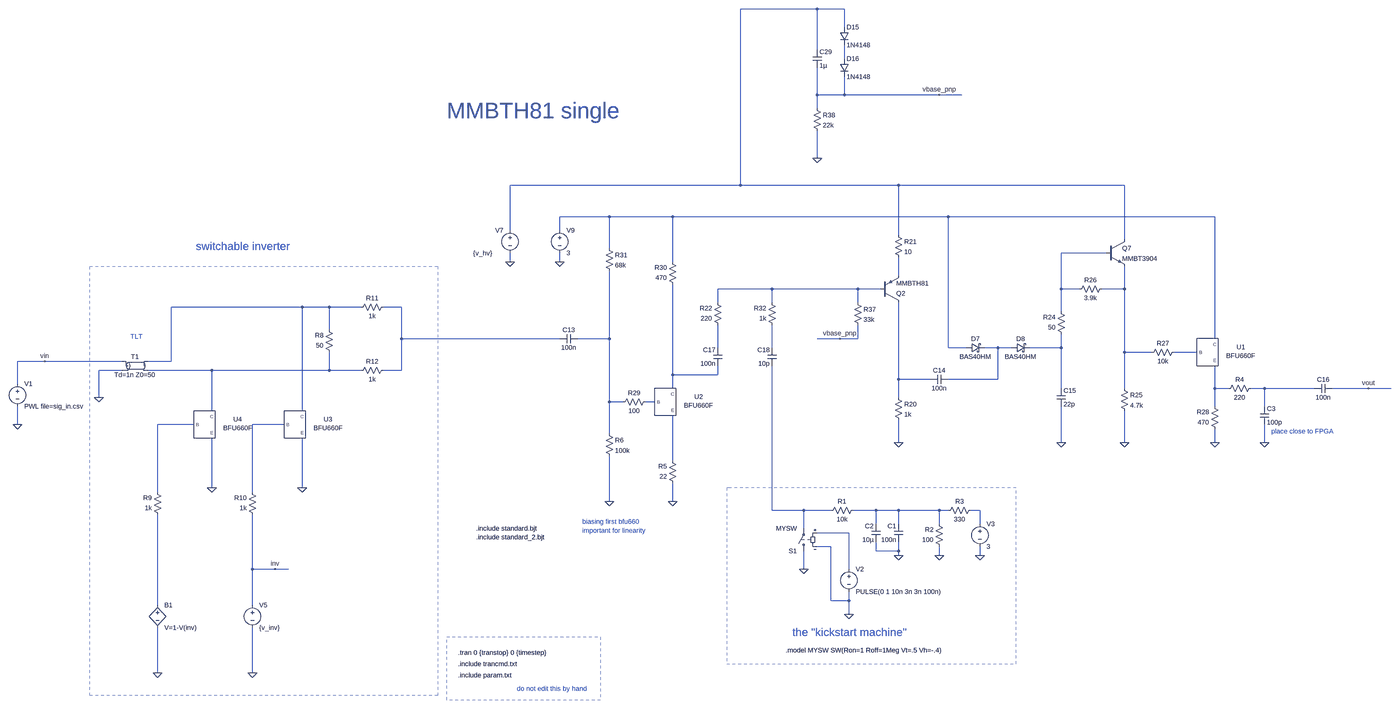
[diagram p0: schematic h81_kickstart_swinv.asc, whole sheet]
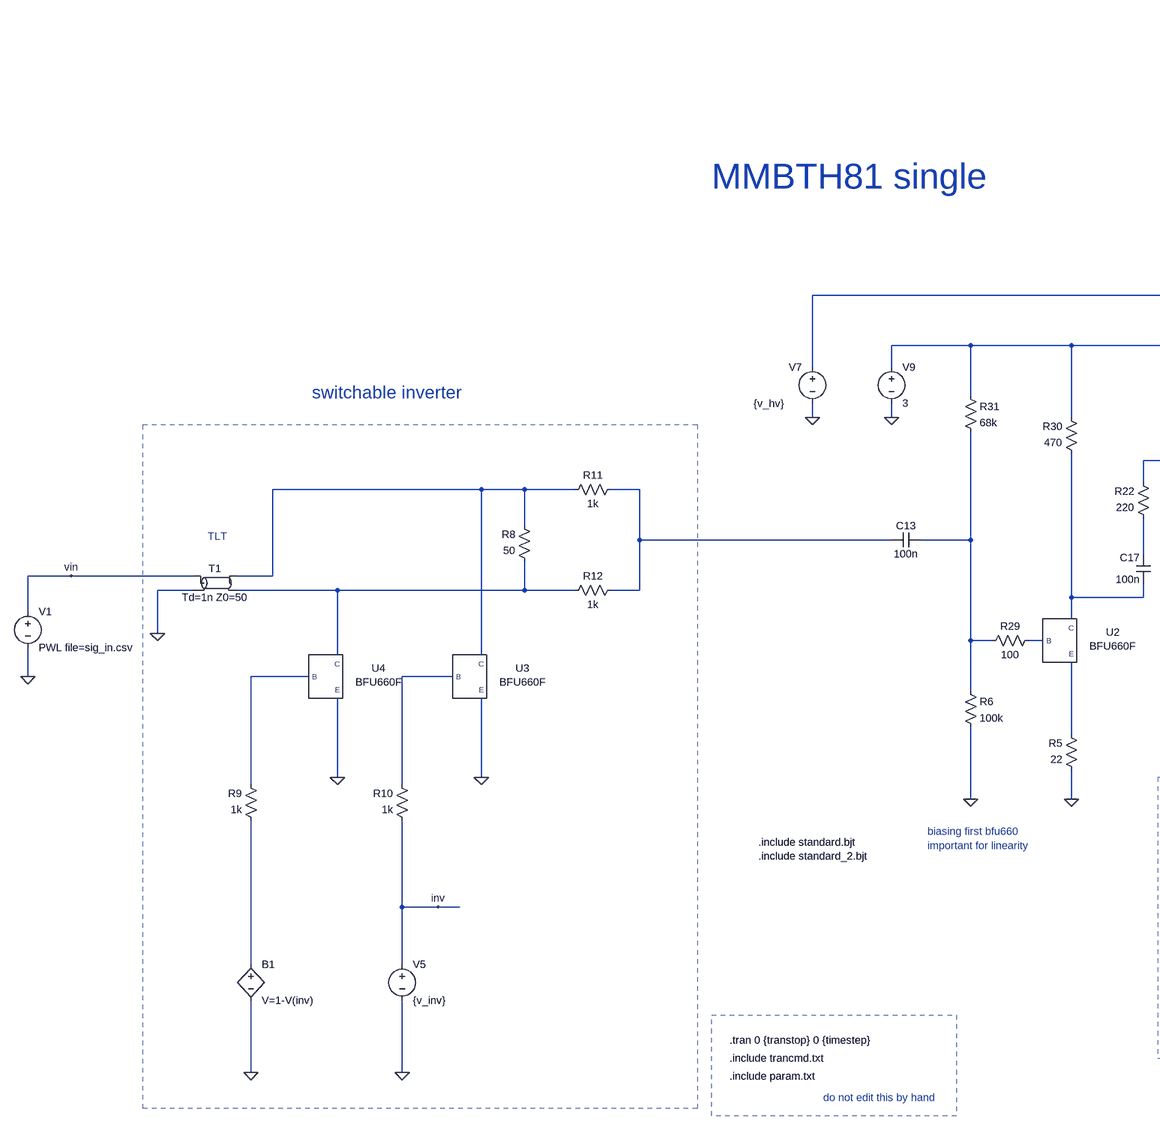
[diagram p1: schematic h81_kickstart_swinv.asc, part, row 1 of 1, column 1 of 2]
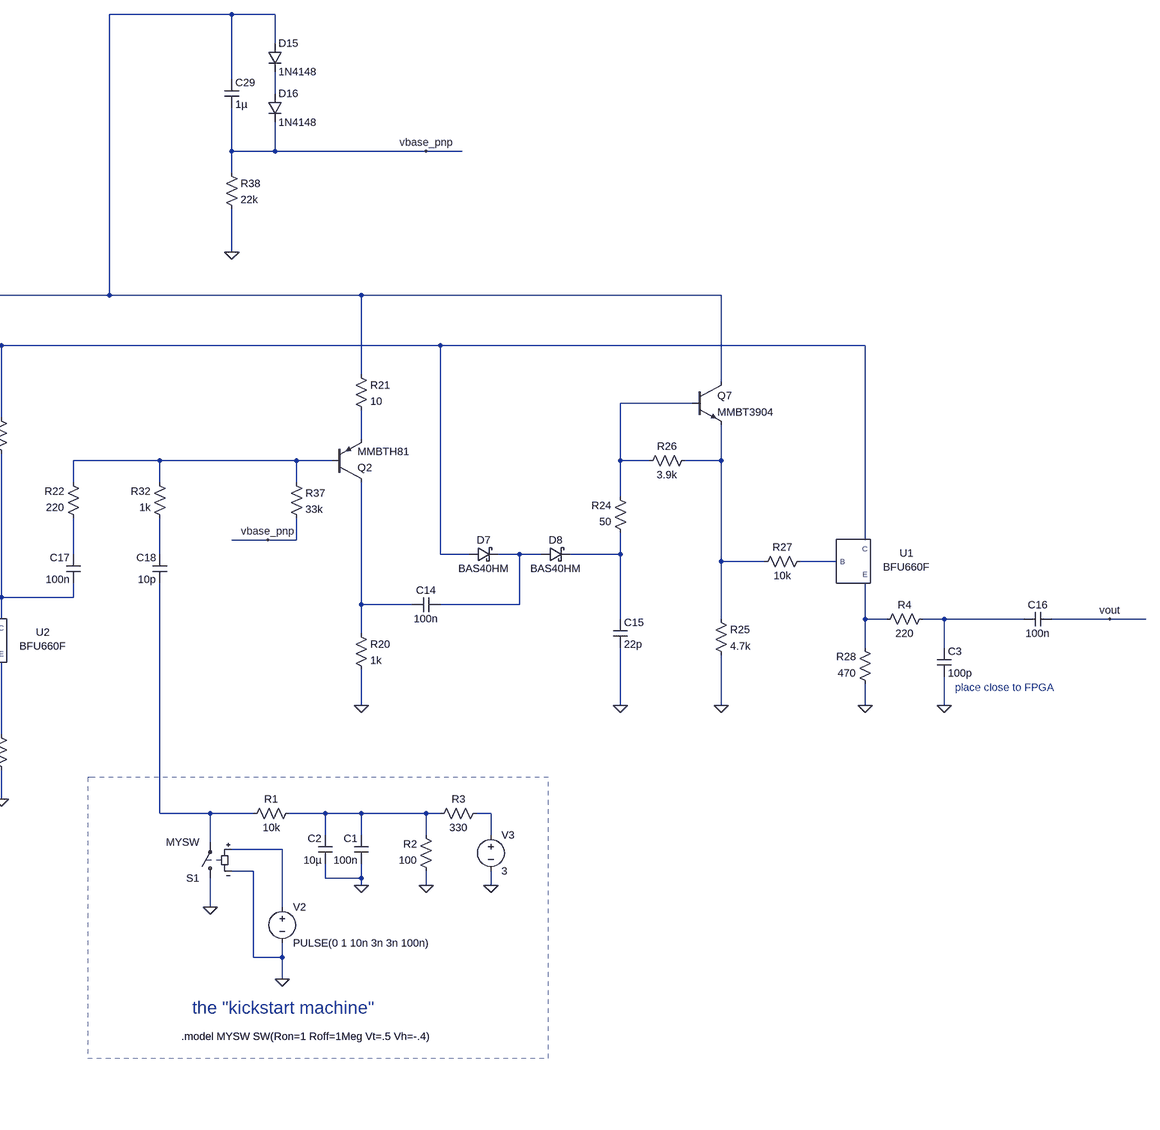
[diagram p2: schematic h81_kickstart_swinv.asc, part, row 1 of 1, column 2 of 2]
h81_kickstart_swinv.asc, the LTspice schematic file:
Version 4
SHEET 1 25452 10420
WIRE 19504 5040 19232 5040
WIRE 19600 5040 19504 5040
WIRE 19600 5104 19600 5040
WIRE 19504 5184 19504 5040
WIRE 19600 5216 19600 5168
WIRE 19504 5344 19504 5248
WIRE 19600 5344 19600 5280
WIRE 19600 5344 19504 5344
WIRE 19936 5344 19600 5344
WIRE 20016 5344 19936 5344
WIRE 19504 5392 19504 5344
WIRE 19504 5568 19504 5472
WIRE 19232 5664 19232 5040
WIRE 19232 5664 18416 5664
WIRE 19792 5664 19232 5664
WIRE 20592 5664 19792 5664
WIRE 18768 5776 18592 5776
WIRE 18992 5776 18768 5776
WIRE 19968 5776 18992 5776
WIRE 20912 5776 19968 5776
WIRE 18416 5824 18416 5664
WIRE 18592 5824 18592 5776
WIRE 19792 5840 19792 5664
WIRE 20592 5856 20592 5664
WIRE 18768 5888 18768 5776
WIRE 20528 5904 20368 5904
WIRE 18416 5936 18416 5904
WIRE 18592 5936 18592 5904
WIRE 18992 5936 18992 5776
WIRE 19792 5984 19792 5920
WIRE 19344 6032 19152 6032
WIRE 19648 6032 19344 6032
WIRE 19728 6032 19648 6032
WIRE 20368 6032 20368 5904
WIRE 20432 6032 20368 6032
WIRE 20592 6032 20592 5952
WIRE 20592 6032 20512 6032
WIRE 19152 6080 19152 6032
WIRE 19344 6080 19344 6032
WIRE 19648 6080 19648 6032
WIRE 17680 6096 17216 6096
WIRE 17776 6096 17680 6096
WIRE 17888 6096 17776 6096
WIRE 18032 6096 17968 6096
WIRE 20368 6112 20368 6032
WIRE 17776 6176 17776 6096
WIRE 18032 6208 18032 6096
WIRE 18592 6208 18032 6208
WIRE 18768 6208 18768 5968
WIRE 18768 6208 18656 6208
WIRE 19584 6208 19504 6208
WIRE 19648 6208 19648 6160
WIRE 19648 6208 19584 6208
WIRE 20912 6208 20912 5776
WIRE 19152 6240 19152 6160
WIRE 19344 6240 19344 6160
WIRE 19968 6240 19968 5776
WIRE 20032 6240 19968 6240
WIRE 20144 6240 20096 6240
WIRE 20192 6240 20144 6240
WIRE 20368 6240 20368 6192
WIRE 20368 6240 20256 6240
WIRE 20592 6256 20592 6032
WIRE 20688 6256 20592 6256
WIRE 20848 6256 20768 6256
WIRE 16768 6288 16672 6288
WIRE 17040 6288 16768 6288
WIRE 17216 6288 17216 6096
WIRE 17216 6288 17136 6288
WIRE 17040 6320 16960 6320
WIRE 17360 6320 17136 6320
WIRE 17776 6320 17776 6256
WIRE 17776 6320 17360 6320
WIRE 17888 6320 17776 6320
WIRE 18032 6320 18032 6208
WIRE 18032 6320 17968 6320
WIRE 18992 6336 18992 6016
WIRE 19152 6336 19152 6304
WIRE 19152 6336 18992 6336
WIRE 19792 6352 19792 6080
WIRE 19904 6352 19792 6352
WIRE 20144 6352 20144 6240
WIRE 20144 6352 19968 6352
WIRE 16672 6368 16672 6288
WIRE 18992 6384 18992 6336
WIRE 20368 6384 20368 6240
WIRE 20592 6384 20592 6256
WIRE 20912 6384 20912 6304
WIRE 20960 6384 20912 6384
WIRE 21088 6384 21040 6384
WIRE 21264 6384 21088 6384
WIRE 21456 6384 21328 6384
WIRE 21536 6384 21456 6384
WIRE 16960 6416 16960 6320
WIRE 19792 6416 19792 6352
WIRE 18768 6432 18768 6208
WIRE 18816 6432 18768 6432
WIRE 18928 6432 18896 6432
WIRE 20912 6448 20912 6384
WIRE 21088 6448 21088 6384
WIRE 17360 6464 17360 6320
WIRE 17680 6464 17680 6096
WIRE 16672 6512 16672 6448
WIRE 17296 6512 17168 6512
WIRE 17616 6512 17504 6512
WIRE 18768 6544 18768 6432
WIRE 19792 6576 19792 6496
WIRE 20368 6576 20368 6448
WIRE 20592 6576 20592 6464
WIRE 20912 6576 20912 6528
WIRE 21088 6576 21088 6512
WIRE 18992 6640 18992 6480
WIRE 17360 6736 17360 6560
WIRE 17680 6736 17680 6560
WIRE 17168 6752 17168 6512
WIRE 17504 6752 17504 6512
WIRE 18768 6784 18768 6624
WIRE 18992 6784 18992 6720
WIRE 19344 6816 19344 6304
WIRE 19456 6816 19344 6816
WIRE 19552 6816 19456 6816
WIRE 19712 6816 19632 6816
WIRE 19792 6816 19712 6816
WIRE 19936 6816 19792 6816
WIRE 19968 6816 19936 6816
WIRE 20080 6816 20048 6816
WIRE 19712 6864 19712 6816
WIRE 19792 6864 19792 6816
WIRE 19936 6864 19936 6816
WIRE 20080 6864 20080 6816
WIRE 19456 6880 19456 6816
WIRE 19616 6896 19504 6896
WIRE 19552 6944 19504 6944
WIRE 19712 6960 19712 6928
WIRE 19792 6960 19792 6928
WIRE 19792 6960 19712 6960
WIRE 19792 6976 19792 6960
WIRE 19936 6976 19936 6944
WIRE 20080 6976 20080 6944
WIRE 17504 7024 17504 6832
WIRE 17584 7024 17504 7024
WIRE 17632 7024 17584 7024
WIRE 19456 7024 19456 6960
WIRE 19616 7024 19616 6896
WIRE 19552 7136 19552 6944
WIRE 19616 7136 19616 7104
WIRE 19616 7136 19552 7136
WIRE 17168 7152 17168 6832
WIRE 17504 7152 17504 7024
WIRE 19616 7184 19616 7136
WIRE 17168 7392 17168 7232
WIRE 17504 7392 17504 7232
FLAG 19792 6576 0
FLAG 20368 6576 0
FLAG 20592 6576 0
FLAG 20912 6576 0
FLAG 18592 5936 0
FLAG 18992 6784 0
FLAG 18416 5936 0
FLAG 19504 5568 0
FLAG 16768 6288 vin
FLAG 16672 6512 0
FLAG 21456 6384 vout
FLAG 19456 7024 0
FLAG 19616 7184 0
FLAG 20080 6976 0
FLAG 19936 6976 0
FLAG 19792 6976 0
FLAG 19584 6208 vbase_pnp
FLAG 19936 5344 vbase_pnp
FLAG 21088 6576 0
FLAG 18768 6784 0
FLAG 16960 6416 0
FLAG 17360 6736 0
FLAG 17680 6736 0
FLAG 17168 7392 0
FLAG 17504 7392 0
FLAG 17584 7024 inv
SYMBOL pnp 19728 6080 M180
SYMATTR InstName Q2
SYMATTR Value MMBTH81
SYMBOL res 19776 6400 R0
SYMATTR InstName R20
SYMATTR Value 1k
SYMBOL res 19776 5824 R0
SYMATTR InstName R21
SYMATTR Value 10
SYMBOL voltage 18416 5808 R0
WINDOW 123 0 0 Left 2
WINDOW 39 14 99 Left 2
WINDOW 0 -52 16 Left 2
WINDOW 3 -131 97 Left 2
SYMATTR InstName V7
SYMATTR Value {v_hv}
SYMBOL res 19168 6176 R180
WINDOW 0 36 76 Left 2
WINDOW 3 36 40 Left 2
SYMATTR InstName R22
SYMATTR Value 220
SYMBOL cap 18656 6192 R90
WINDOW 0 0 32 VBottom 2
WINDOW 3 32 32 VTop 2
SYMATTR InstName C13
SYMATTR Value 100n
SYMBOL cap 19968 6336 R90
WINDOW 0 0 32 VBottom 2
WINDOW 3 32 32 VTop 2
SYMATTR InstName C14
SYMATTR Value 100n
SYMBOL cap 20352 6384 R0
SYMATTR InstName C15
SYMATTR Value 22p
SYMBOL schottky 20032 6256 R270
WINDOW 3 0 32 VBottom 2
WINDOW 0 32 32 VTop 2
SYMATTR Value BAS40HM
SYMATTR InstName D7
SYMATTR Description Diode
SYMATTR Type diode
SYMBOL schottky 20192 6256 R270
WINDOW 3 0 32 VBottom 2
WINDOW 0 32 32 VTop 2
SYMATTR Value BAS40HM
SYMATTR InstName D8
SYMATTR Description Diode
SYMATTR Type diode
SYMBOL res 20384 6208 R180
WINDOW 0 36 76 Left 2
WINDOW 3 36 40 Left 2
SYMATTR InstName R24
SYMATTR Value 50
SYMBOL res 20576 6368 R0
SYMATTR InstName R25
SYMATTR Value 4.7k
SYMBOL npn 20528 5856 R0
SYMATTR InstName Q7
SYMATTR Value MMBT3904
SYMBOL res 20528 6016 R90
WINDOW 0 0 56 VBottom 2
WINDOW 3 32 56 VTop 2
SYMATTR InstName R26
SYMATTR Value 3.9k
SYMBOL res 20784 6240 R90
WINDOW 0 0 56 VBottom 2
WINDOW 3 32 56 VTop 2
SYMATTR InstName R27
SYMATTR Value 10k
SYMBOL res 20928 6544 R180
WINDOW 0 36 76 Left 2
WINDOW 3 36 40 Left 2
SYMATTR InstName R28
SYMATTR Value 470
SYMBOL cap 21328 6368 R90
WINDOW 0 0 32 VBottom 2
WINDOW 3 32 32 VTop 2
SYMATTR InstName C16
SYMATTR Value 100n
SYMBOL res 18912 6416 R90
WINDOW 0 0 56 VBottom 2
WINDOW 3 32 56 VTop 2
SYMATTR InstName R29
SYMATTR Value 100
SYMBOL res 19008 6032 R180
WINDOW 0 36 76 Left 2
WINDOW 3 36 40 Left 2
SYMATTR InstName R30
SYMATTR Value 470
SYMBOL voltage 18592 5808 R0
SYMATTR InstName V9
SYMATTR Value 3
SYMBOL cap 19168 6304 R180
WINDOW 0 24 56 Left 2
WINDOW 3 24 8 Left 2
SYMATTR InstName C17
SYMATTR Value 100n
SYMBOL res 18752 5872 R0
SYMATTR InstName R31
SYMATTR Value 68k
SYMBOL res 19360 6176 R180
WINDOW 0 36 76 Left 2
WINDOW 3 36 40 Left 2
SYMATTR InstName R32
SYMATTR Value 1k
SYMBOL cap 19360 6304 R180
WINDOW 0 24 56 Left 2
WINDOW 3 24 8 Left 2
SYMATTR InstName C18
SYMATTR Value 10p
SYMBOL res 19632 6064 R0
SYMATTR InstName R37
SYMATTR Value 33k
SYMBOL diode 19584 5104 R0
SYMATTR InstName D15
SYMATTR Value 1N4148
SYMBOL diode 19584 5216 R0
SYMATTR InstName D16
SYMATTR Value 1N4148
SYMBOL cap 19488 5184 R0
SYMATTR InstName C29
SYMATTR Value 1µ
SYMBOL res 19488 5376 R0
SYMATTR InstName R38
SYMATTR Value 22k
SYMBOL voltage 16672 6352 R0
WINDOW 39 0 0 Left 0
SYMATTR InstName V1
SYMATTR Value PWL file=sig_in.csv
SYMBOL sw 19456 6976 R180
SYMATTR InstName S1
SYMATTR Value MYSW
SYMBOL voltage 19616 7008 R0
WINDOW 123 0 0 Left 0
WINDOW 39 0 0 Left 0
SYMATTR InstName V2
SYMATTR Value PULSE(0 1 10n 3n 3n 100n)
SYMBOL res 19648 6800 R90
WINDOW 0 0 56 VBottom 2
WINDOW 3 32 56 VTop 2
SYMATTR InstName R1
SYMATTR Value 10k
SYMBOL voltage 20080 6848 R0
SYMATTR InstName V3
SYMATTR Value 3
SYMBOL res 19952 6960 R180
WINDOW 0 36 76 Left 2
WINDOW 3 36 40 Left 2
SYMATTR InstName R2
SYMATTR Value 100
SYMBOL res 19952 6832 R270
WINDOW 0 32 56 VTop 2
WINDOW 3 0 56 VBottom 2
SYMATTR InstName R3
SYMATTR Value 330
SYMBOL cap 19808 6928 R180
WINDOW 0 24 56 Left 2
WINDOW 3 24 8 Left 2
SYMATTR InstName C1
SYMATTR Value 100n
SYMBOL cap 19728 6928 R180
WINDOW 0 24 56 Left 2
WINDOW 3 24 8 Left 2
SYMATTR InstName C2
SYMATTR Value 10µ
SYMBOL BFU660F 20880 6256 R0
SYMATTR InstName U1
SYMBOL res 21056 6368 R90
WINDOW 0 0 56 VBottom 2
WINDOW 3 32 56 VTop 2
SYMATTR InstName R4
SYMATTR Value 220
SYMBOL cap 21072 6448 R0
SYMATTR InstName C3
SYMATTR Value 100p
SYMBOL res 19008 6736 R180
WINDOW 0 36 76 Left 2
WINDOW 3 36 40 Left 2
SYMATTR InstName R5
SYMATTR Value 22
SYMBOL res 18752 6528 R0
SYMATTR InstName R6
SYMATTR Value 100k
SYMBOL BFU660F 18960 6432 R0
SYMATTR InstName U2
SYMBOL tline 17088 6304 R0
SYMATTR InstName T1
SYMATTR Value Td=1n Z0=50
SYMBOL res 17792 6272 R180
WINDOW 0 36 76 Left 2
WINDOW 3 36 40 Left 2
SYMATTR InstName R8
SYMATTR Value 50
SYMBOL voltage 17504 7136 R0
WINDOW 123 0 0 Left 0
WINDOW 39 0 0 Left 0
SYMATTR InstName V5
SYMATTR Value {v_inv}
SYMBOL res 17184 6848 R180
WINDOW 0 36 76 Left 2
WINDOW 3 36 40 Left 2
SYMATTR InstName R9
SYMATTR Value 1k
SYMBOL res 17520 6848 R180
WINDOW 0 36 76 Left 2
WINDOW 3 36 40 Left 2
SYMATTR InstName R10
SYMATTR Value 1k
SYMBOL res 17872 6112 R270
WINDOW 0 32 56 VTop 2
WINDOW 3 0 56 VBottom 2
SYMATTR InstName R11
SYMATTR Value 1k
SYMBOL res 17872 6336 R270
WINDOW 0 32 56 VTop 2
WINDOW 3 0 56 VBottom 2
SYMATTR InstName R12
SYMATTR Value 1k
SYMBOL BFU660F 17648 6512 R0
SYMATTR InstName U3
SYMBOL BFU660F 17328 6512 R0
SYMATTR InstName U4
SYMBOL bv 17168 7136 R0
SYMATTR InstName B1
SYMATTR Value V=1-V(inv)
TEXT 18296 6880 Left 2 !.include standard.bjt\n.include standard_2.bjt
TEXT 19392 7312 Left 2 !.model MYSW SW(Ron=1 Roff=1Meg Vt=.5 Vh=-.4)
TEXT 18192 5400 Left 6 ;MMBTH81 single
TEXT 18232 7320 Left 2 !.tran 0 {transtop} 0 {timestep}
TEXT 18232 7400 Left 2 !.include param.txt
TEXT 18232 7360 Left 2 !.include trancmd.txt
TEXT 18440 7448 Left 2 ;do not edit this by hand
TEXT 19416 7248 Left 4 ;the "kickstart machine"
TEXT 21112 6536 Left 2 ;place close to FPGA
TEXT 18672 6856 Left 2 ;biasing first bfu660\nimportant for linearity
TEXT 17072 6200 Left 2 ;TLT
TEXT 17304 5880 Left 4 ;switchable inverter
LINE Normal 20208 6736 19200 6736 2
LINE Normal 20208 7360 20208 6736 2
LINE Normal 19184 7360 20208 7360 2
LINE Normal 19184 6736 19184 7360 2
LINE Normal 19200 6736 19184 6736 2
LINE Normal 19264 6736 19264 6736 2
LINE Normal 19264 6736 19264 6736 2
LINE Normal 16928 7472 16928 5984 2
LINE Normal 18160 7472 16928 7472 2
LINE Normal 18160 5952 18160 7472 2
LINE Normal 16928 5952 18160 5952 2
LINE Normal 16928 5984 16928 5952 2
RECTANGLE Normal 18736 7488 18192 7264 2

The netlist it stands for:
* h81_kickstart_swinv.asc
Q2 N018 N006 N005 0 MMBTH81
R20 N018 0 1k
R21 N001 N005 10
V7 N001 0 {v_hv}
R22 N011 N006 220
C13 N010 N009 100n
C14 N013 N018 100n
C15 N014 0 22p
D7 N003 N013 BAS40HM
D8 N013 N014 BAS40HM
R24 N014 N004 50
R25 N007 0 4.7k
Q7 N001 N004 N007 0 MMBT3904
R26 N007 N004 3.9k
R27 N015 N007 10k
R28 0 N019 470
C16 vout N020 100n
R29 N021 N010 100
R30 N017 N003 470
V9 N003 0 3
C17 N017 N011 100n
R31 N003 N010 68k
R32 N012 N006 1k
C18 N025 N012 10p
R37 N006 vbase_pnp 33k
D15 N001 N002 1N4148
D16 N002 vbase_pnp 1N4148
C29 N001 vbase_pnp 1µ
R38 vbase_pnp 0 22k
V1 vin 0 PWL file=sig_in.csv
S1 0 N025 N028 0 MYSW
V2 N028 0 PULSE(0 1 10n 3n 3n 100n)
R1 N026 N025 10k
V3 N027 0 3
R2 0 N026 100
R3 N026 N027 330
C1 0 N026 100n
C2 0 N026 10µ
XU1 N003 N015 N019 BFU660F  ; pins C B E
R4 N020 N019 220
C3 N020 0 100p
R5 0 N024 22
R6 N010 0 100k
XU2 N017 N021 N024 BFU660F  ; pins C B E
T1 vin 0 N008 N016 Td=1n Z0=50
R8 N016 N008 50
V5 inv 0 {v_inv}
R9 N029 N022 1k
R10 inv N023 1k
R11 N008 N009 1k
R12 N016 N009 1k
XU3 N008 N023 0 BFU660F  ; pins C B E
XU4 N016 N022 0 BFU660F  ; pins C B E
B1 N029 0 V=1-V(inv)
.model D D
.lib standard.dio
.model NPN NPN
.model PNP PNP
.lib standard.bjt
.include standard.bjt
.include standard_2.bjt
.model MYSW SW(Ron=1 Roff=1Meg Vt=.5 Vh=-.4)
* MMBTH81 single
.tran 0 {transtop} 0 {timestep}
.include param.txt
.include trancmd.txt
* do not edit this by hand
* the "kickstart machine"
* place close to FPGA
* biasing first bfu660
* important for linearity
* TLT
* switchable inverter
.lib BFU660F.txt
.backanno
.end